# Altium schematic sheet Sheet1.SchDoc
size A; SheetNumber: 1; SheetTotal: 1
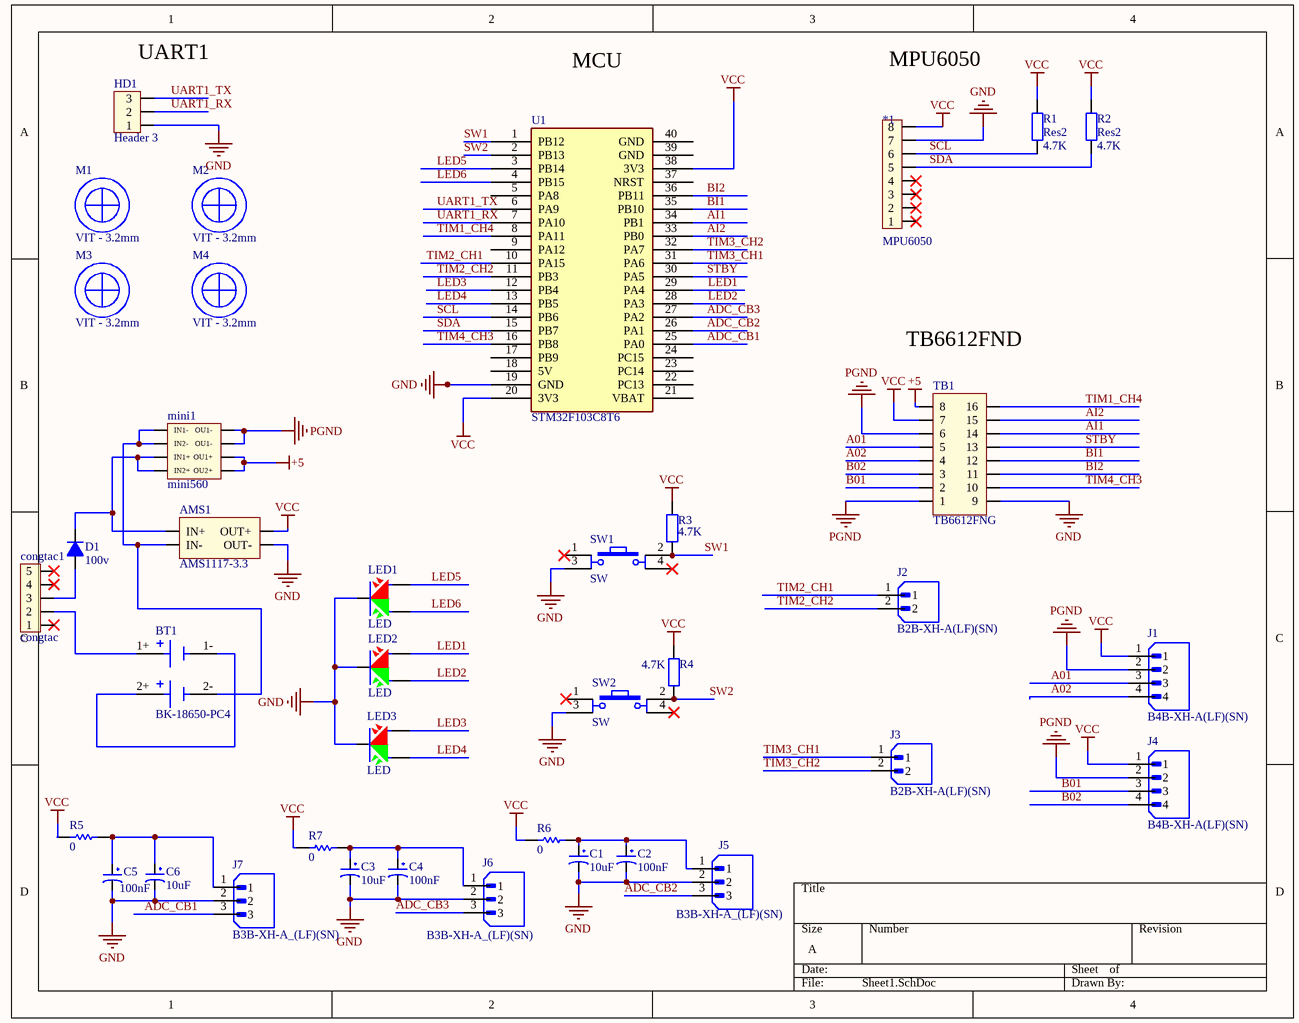
[diagram p0: Sheet1.SchDoc]

## Parts
*1  MPU6050  [MPU6050]
AMS1  AMS1117-3.3  [ASM1117-3.3]
BT1  BK-18650-PC4  [BAT_BK-18650-PC4]
C1  10uF  [CP1/2]
C2  100nF  [CP1/2]
C3  10uF  [CP1/2]
C4  100nF  [CP1/2]
C5  100nF  [CP1/2]
C6  10uF  [CP1/2]
congtac1  congtac  [congtac]
D1  100v  [Diode 1N4007]
HD1  Header 3  [Header_3]
J1  B4B-XH-A(LF)(SN)  [JST_B4B-XH-A(LF)(SN)]
J2  B2B-XH-A(LF)(SN)  [JST_B2B-XH-A(LF)(SN)]
J3  B2B-XH-A(LF)(SN)  [JST_B2B-XH-A(LF)(SN)]
J4  B4B-XH-A(LF)(SN)  [JST_B4B-XH-A(LF)(SN)]
J5  B3B-XH-A_(LF)(SN)  [JST_B3B-XH-A (LF)(SN)]
J6  B3B-XH-A_(LF)(SN)  [JST_B3B-XH-A (LF)(SN)]
J7  B3B-XH-A_(LF)(SN)  [JST_B3B-XH-A (LF)(SN)]
LED1  LED  [LED-52]
LED2  LED  [LED-52]
LED3  LED  [LED-52]
M1  VIT - 3.2mm  [VIT - 3.2mm]
M2  VIT - 3.2mm  [VIT - 3.2mm]
M3  VIT - 3.2mm  [VIT - 3.2mm]
M4  VIT - 3.2mm  [VIT - 3.2mm]
mini1  mini560  [mini540]
R1  Res2  value 4.7K  [RES 1/4W CFR25]
R2  Res2  value 4.7K  [RES 1/4W CFR25]
R3  value 4.7K  [RES 1/4W CFR25]  (hidden comment: Res2)
R4  value 4.7K  [RES 1/4W CFR25]  (hidden comment: Res2)
R5  0  [Res 1206 SMD]
R6  0  [Res 1206 SMD]
R7  0  [Res 1206 SMD]
SW1  SW  [SW4]
SW2  SW  [SW4]
TB1  TB6612FNG  [TB6612PNG]
U1  STM32F103C8T6  [Stm32 BluePill]

## Nets
+5: mini1.7(OU1+) mini1.8(OU2+) TB1.8
GND: *1.7 AMS1.4(OUT-) C1.2 C2.2 C3.2 C4.2 C5.2 C6.2 HD1.1 J5.2 J6.2 J7.2 LED1.2 LED2.2 LED3.2 SW1.3 SW2.3 TB1.9 U1.19(GND)
PGND: J1.2 J4.2 mini1.5(OU1-) mini1.6(OU1-) TB1.1 TB1.6
VCC: *1.8 AMS1.3(OUT+) J1.1 J4.1 R1.2 R2.2 R3.2 R4.2 R5.2 R6.2 R7.2 TB1.7 U1.20(3V3) U1.38(3V3)
A01: J1.3 TB1.5
A02: J1.4 TB1.4
ADC_CB1: J7.3 U1.25(PA0)
ADC_CB2: J5.3 U1.26(PA1)
ADC_CB3: J6.3 U1.27(PA2)
AI1: TB1.14 U1.34(PB1)
AI2: TB1.15 U1.33(PB0)
B01: J4.3 TB1.2
B02: J4.4 TB1.3
BI1: TB1.12 U1.35(PB10)
BI2: TB1.11 U1.36(PB11)
LED1: LED2.1 U1.29(PA4)
LED2: LED2.3 U1.28(PA3)
LED3: LED3.1 U1.12(PB4)
LED4: LED3.3 U1.13(PB5)
LED5: LED1.1 U1.3(PB14)
LED6: LED1.3 U1.4(PB15)
SCL: *1.6 R1.1 U1.14(PB6)
SDA: *1.5 R2.1 U1.15(PB7)
STBY: TB1.13 U1.30(PA5)
SW1: R3.1 SW1.2 U1.1(PB12)
SW2: R4.1 SW2.2 U1.2(PB13)
TIM1_CH4: TB1.16 U1.8(PA11)
TIM2_CH1: J2.1 U1.10(PA15)
TIM2_CH2: J2.2 U1.11(PB3)
TIM3_CH1: J3.1 U1.31(PA6)
TIM3_CH2: J3.2 U1.32(PA7)
TIM4_CH3: TB1.10 U1.16(PB8)
UART1_RX: HD1.2 U1.7(PA10)
UART1_TX: HD1.3 U1.6(PA9)
NetAMS1_1: AMS1.1(IN+) D1.2(K) mini1.3(IN1+) mini1.4(IN2+)
NetAMS1_2: AMS1.2(IN-) BT1.2- mini1.1(IN1-) mini1.2(IN2-)
NetBT1_1+: BT1.1+ congtac1.2
NetBT1_1-: BT1.1- BT1.2+
NetC1_1: C1.1 C2.1 J5.1 R6.1
NetC3_1: C3.1 C4.1 J6.1 R7.1
NetC5_1: C5.1 C6.1 J7.1 R5.1
Netcongtac1_3: congtac1.3 D1.1(A)

Not connected (* = marked no-connect by the designer): *1 1* 2* 3* 4*; congtac1 1* 4* 5*; SW1 1* 4*; SW2 1* 4*; U1 5(PA8) 9(PA12) 17(PB9) 18(5V) 21(VBAT) 22(PC13) 23(PC14) 24(PC15) 37(NRST) 39(GND) 40(GND)

## Notes on the sheet
- (near HD1) UART1
- MCU
- MPU6050
- TB6612FND

## Library data of the parts
BT1 = BK-18650-PC4: Battery Holder (Open) 18650 2 Cell PC Pin; Price: None; Value: *; Package: None; Availability: Unavailable; MP: BK-18650-PC4
C1-C6 = CP1: Cap P  0,1uF < 22uF , 16 - 50V; Value: 10uF/50V; Description 1: 10 => 220uF/6,3V/10V - 10uF => 100uF/16V; Description 2: 0,1uF => 33uF/50V - 10uF => 22uF/63V; Description 3: 0,47uF => 10uF/100V
D1 = Diode 1N4148: Cắm; Ten_Linh_Kien: Diode 1N4148 DO35 450mA 100V ( 1N4148 DIP); Don_Vi: Con; Ma_Hang: MH001065; Ghi Chu: *; Kieu_Chan: *; Chung_Loai: Cắm
HD1 = Header3: Value: Header 3
J1 J4 = B4B-XH-A(LF)(SN): Connector Header Through Hole 4 position 0.098 (2.50mm); MF: JST Sales; SnapEDA_Link: https://www.snapeda.com/parts/B4B-XH-A(LF)(SN)/JST+Sales+America+Inc./view-part/?ref=snap; Package: None; Value: *; MP: B4B-XH-A(LF)(SN); Check_prices: https://www.snapeda.com/parts/B4B-XH-A(LF)(SN)/JST+Sales+America+Inc./view-part/?ref=eda
J2 J3 = B2B-XH-A(LF)(SN): Connector Header Through Hole 2 position 0.098 (2.50mm); MF: JST Sales America Inc.; SnapEDA_Link: https://www.snapeda.com/parts/B2B-XH-A(LF)(SN)/JST+Sales+America+Inc./view-part/?ref=snap; Package: None; Value: *; MP: B2B-XH-A(LF)(SN); Check_prices: https://www.snapeda.com/parts/B2B-XH-A(LF)(SN)/JST+Sales+America+Inc./view-part/?ref=eda
J5-J7 = B3B-XH-A_(LF)(SN): Connector Header Through Hole 3 position 0.098 (2.50mm); MF: JST Sales America Inc.; MP: B3B-XH-A (LF)(SN); SnapEDA_Link: https://www.snapeda.com/parts/B3B-XH-A%20(LF)(SN)/JST+Sales+America+Inc./view-part/?ref=snap; Package: None; Value: *; Check_prices: https://www.snapeda.com/parts/B3B-XH-A%20(LF)(SN)/JST+Sales+America+Inc./view-part/?ref=eda
LED1-LED3 = LED2: LED 2 colour Green and Red; Value: LED 3 - 5 ly 2 Colour
R1-R4 = Res2: Resistor; Published: 8-Jun-2000; LatestRevisionDate: 17-Jul-2002; LatestRevisionNote: Re-released for DXP Platform.; PackageReference: AXIAL-0.4; Publisher: Altium Limited; PackageDescription: Axial Device, Thru-Hole; 2 Leads; 0.4 in Pin Spacing
R5-R7 = RES-1206: RES SMD 5.1 OHM 1% 1/4W 1206; Manufacturer: Yageo; Manufacturer Part Number: RC1206FR-075R1L; Resistance (Ohms): 5.1; Power (Watts): 0.25W, 1/4W; Temperature Coefficient: ±200ppm/°C; Supplier 1: Digi-Key; RoHS: RoHS Compliant; Category: Resistors; Stock 1: 96701; Pricing 1: 1=0.1, 10=0.051, 100=0.0207, 1000=0.0093, 2500=0.00807 (USD); Packaging: Cut Tape (CT); Part Status: Active; Tolerance: ±1%; Composition: Thick Film; Features: Moisture Resistant; Operating Temperature: -55°C ~ 155°C; Package / Case: 1206 (3216 Metric); Supplier Device Package: 1206; Size / Dimension: 0.122" L x 0.063" W (3.10mm x 1.60mm); Height - Seated (Max): 0.026" (0.65mm); Failure Rate: -; ComponentLink1URL: http://www.yageo.com/documents/recent/PYu-RC_Group_51_RoHS_L_7.pdf; ComponentLink1Description: http://www.yageo.com/documents/recent/PYu-RC_Group_51_RoHS_L_7.pdf; Supplier Part Number 1: 311-5.10FRCT-ND
SW1 SW2 = SW4: Switch button 4 pin; Value: Button chip 4 pin
U1 = BluePill: Designed By @Alixahedi